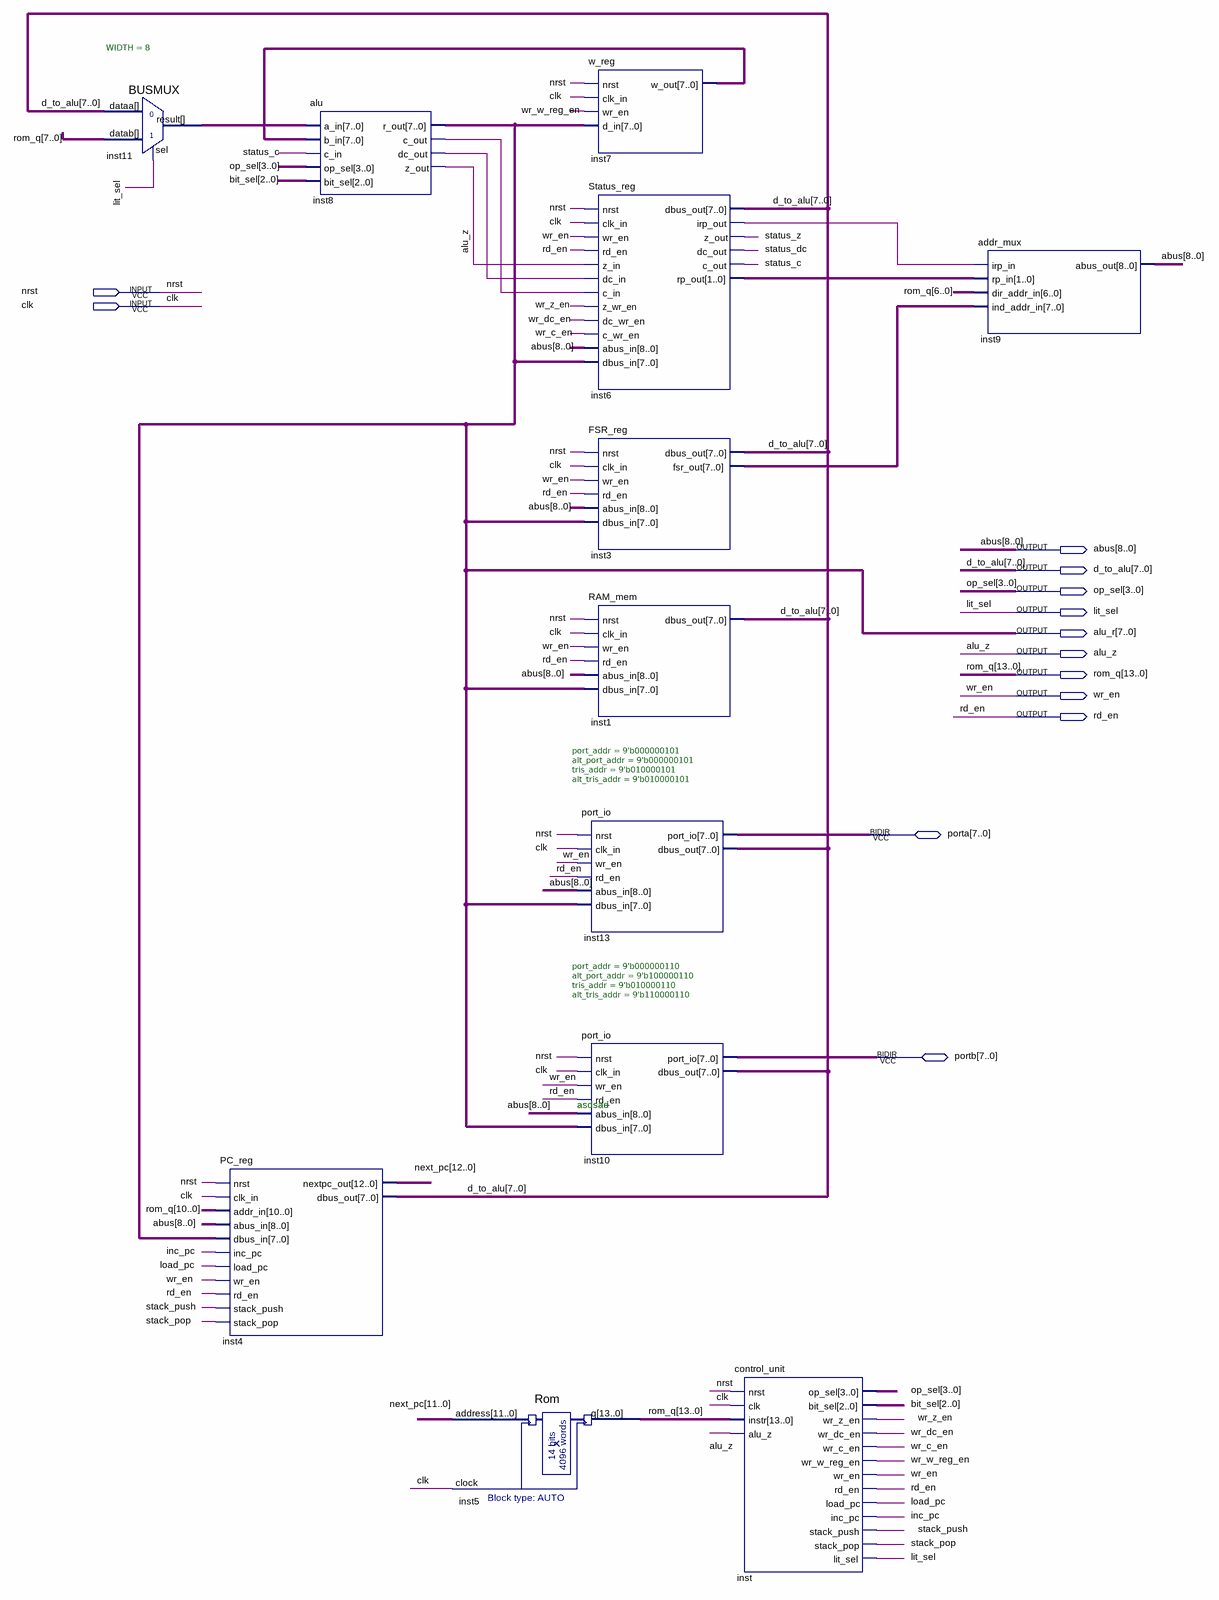
[diagram p0: schematic sheet]
// Quartus schematic main.bdf as structural Verilog: 12 symbols, 13 pins
module main (
  input  nrst,
  input  clk,
  inout  [7:0] porta,
  inout  [7:0] portb,
  output [8:0] abus,
  output [7:0] d_to_alu,
  output [3:0] op_sel,
  output lit_sel,
  output [7:0] alu_r,
  output alu_z,
  output [13:0] rom_q,
  output wr_en,
  output rd_en
);

  wire inc_pc, inst6_irp_out, inst8_c_out, inst8_dc_out, load_pc, stack_pop, stack_push, status_c, status_dc,
       status_z, wr_c_en, wr_dc_en, wr_w_reg_en, wr_z_en;
  wire [1:0] inst6_rp_out;
  wire [2:0] bit_sel;
  wire [7:0] inst3_fsr_out, inst7_w_out, inst11_result;
  wire [12:0] next_pc;

  BUSMUX #(.WIDTH(8)) inst11 (.datab(rom_q[7:0]), .sel(lit_sel), .dataa(d_to_alu), .result(inst11_result));
  PC_reg inst4 (
    .nrst(nrst), .clk_in(clk), .addr_in(rom_q[10:0]), .abus_in(abus), .dbus_in(alu_r), .inc_pc(inc_pc),
    .load_pc(load_pc), .wr_en(wr_en), .rd_en(rd_en), .stack_push(stack_push), .stack_pop(stack_pop),
    .nextpc_out(next_pc), .dbus_out(d_to_alu));
  alu inst8 (
    .a_in(inst11_result), .b_in(inst7_w_out), .c_in(status_c), .op_sel(op_sel), .bit_sel(bit_sel),
    .r_out(alu_r), .c_out(inst8_c_out), .dc_out(inst8_dc_out), .z_out(alu_z));
  Rom inst5 (.address(next_pc[11:0]), .clock(clk), .q(rom_q));
  w_reg inst7 (.nrst(nrst), .clk_in(clk), .wr_en(wr_w_reg_en), .d_in(alu_r), .w_out(inst7_w_out));
  Status_reg inst6 (
    .nrst(nrst), .clk_in(clk), .wr_en(wr_en), .rd_en(rd_en), .z_in(alu_z), .dc_in(inst8_dc_out),
    .c_in(inst8_c_out), .z_wr_en(wr_z_en), .dc_wr_en(wr_dc_en), .c_wr_en(wr_c_en), .abus_in(abus),
    .dbus_in(alu_r), .dbus_out(d_to_alu), .irp_out(inst6_irp_out), .z_out(status_z), .dc_out(status_dc),
    .c_out(status_c), .rp_out(inst6_rp_out));
  FSR_reg inst3 (
    .nrst(nrst), .clk_in(clk), .wr_en(wr_en), .rd_en(rd_en), .abus_in(abus), .dbus_in(alu_r),
    .dbus_out(d_to_alu), .fsr_out(inst3_fsr_out));
  RAM_mem inst1 (
    .nrst(nrst), .clk_in(clk), .wr_en(wr_en), .rd_en(rd_en), .abus_in(abus), .dbus_in(alu_r),
    .dbus_out(d_to_alu));
  port_io #(.port_addr(9'b000000101), .alt_port_addr(9'b000000101), .tris_addr(9'b010000101), .alt_tris_addr(9'b010000101)) inst13 (
    .nrst(nrst), .clk_in(clk), .wr_en(wr_en), .rd_en(rd_en), .abus_in(abus), .dbus_in(alu_r),
    .dbus_out(d_to_alu), .port_io(porta));
  port_io #(.port_addr(9'b000000110), .alt_port_addr(9'b100000110), .tris_addr(9'b010000110), .alt_tris_addr(9'b110000110)) inst10 (
    .nrst(nrst), .clk_in(clk), .wr_en(wr_en), .rd_en(rd_en), .abus_in(abus), .dbus_in(alu_r),
    .dbus_out(d_to_alu), .port_io(portb));
  control_unit inst (
    .nrst(nrst), .clk(clk), .instr(rom_q), .alu_z(alu_z), .op_sel(op_sel), .bit_sel(bit_sel),
    .wr_z_en(wr_z_en), .wr_dc_en(wr_dc_en), .wr_c_en(wr_c_en), .wr_w_reg_en(wr_w_reg_en), .wr_en(wr_en),
    .rd_en(rd_en), .load_pc(load_pc), .inc_pc(inc_pc), .stack_push(stack_push), .stack_pop(stack_pop),
    .lit_sel(lit_sel));
  addr_mux inst9 (
    .irp_in(inst6_irp_out), .rp_in(inst6_rp_out), .dir_addr_in(rom_q[6:0]), .ind_addr_in(inst3_fsr_out),
    .abus_out(abus));

  // Notes on the sheet:
  //   asdsad
endmodule
